# EasyEDA Pro project ProPrj_SRC_Robot2025_V1.0_2026-09-06.epro, board PCB-CTRL
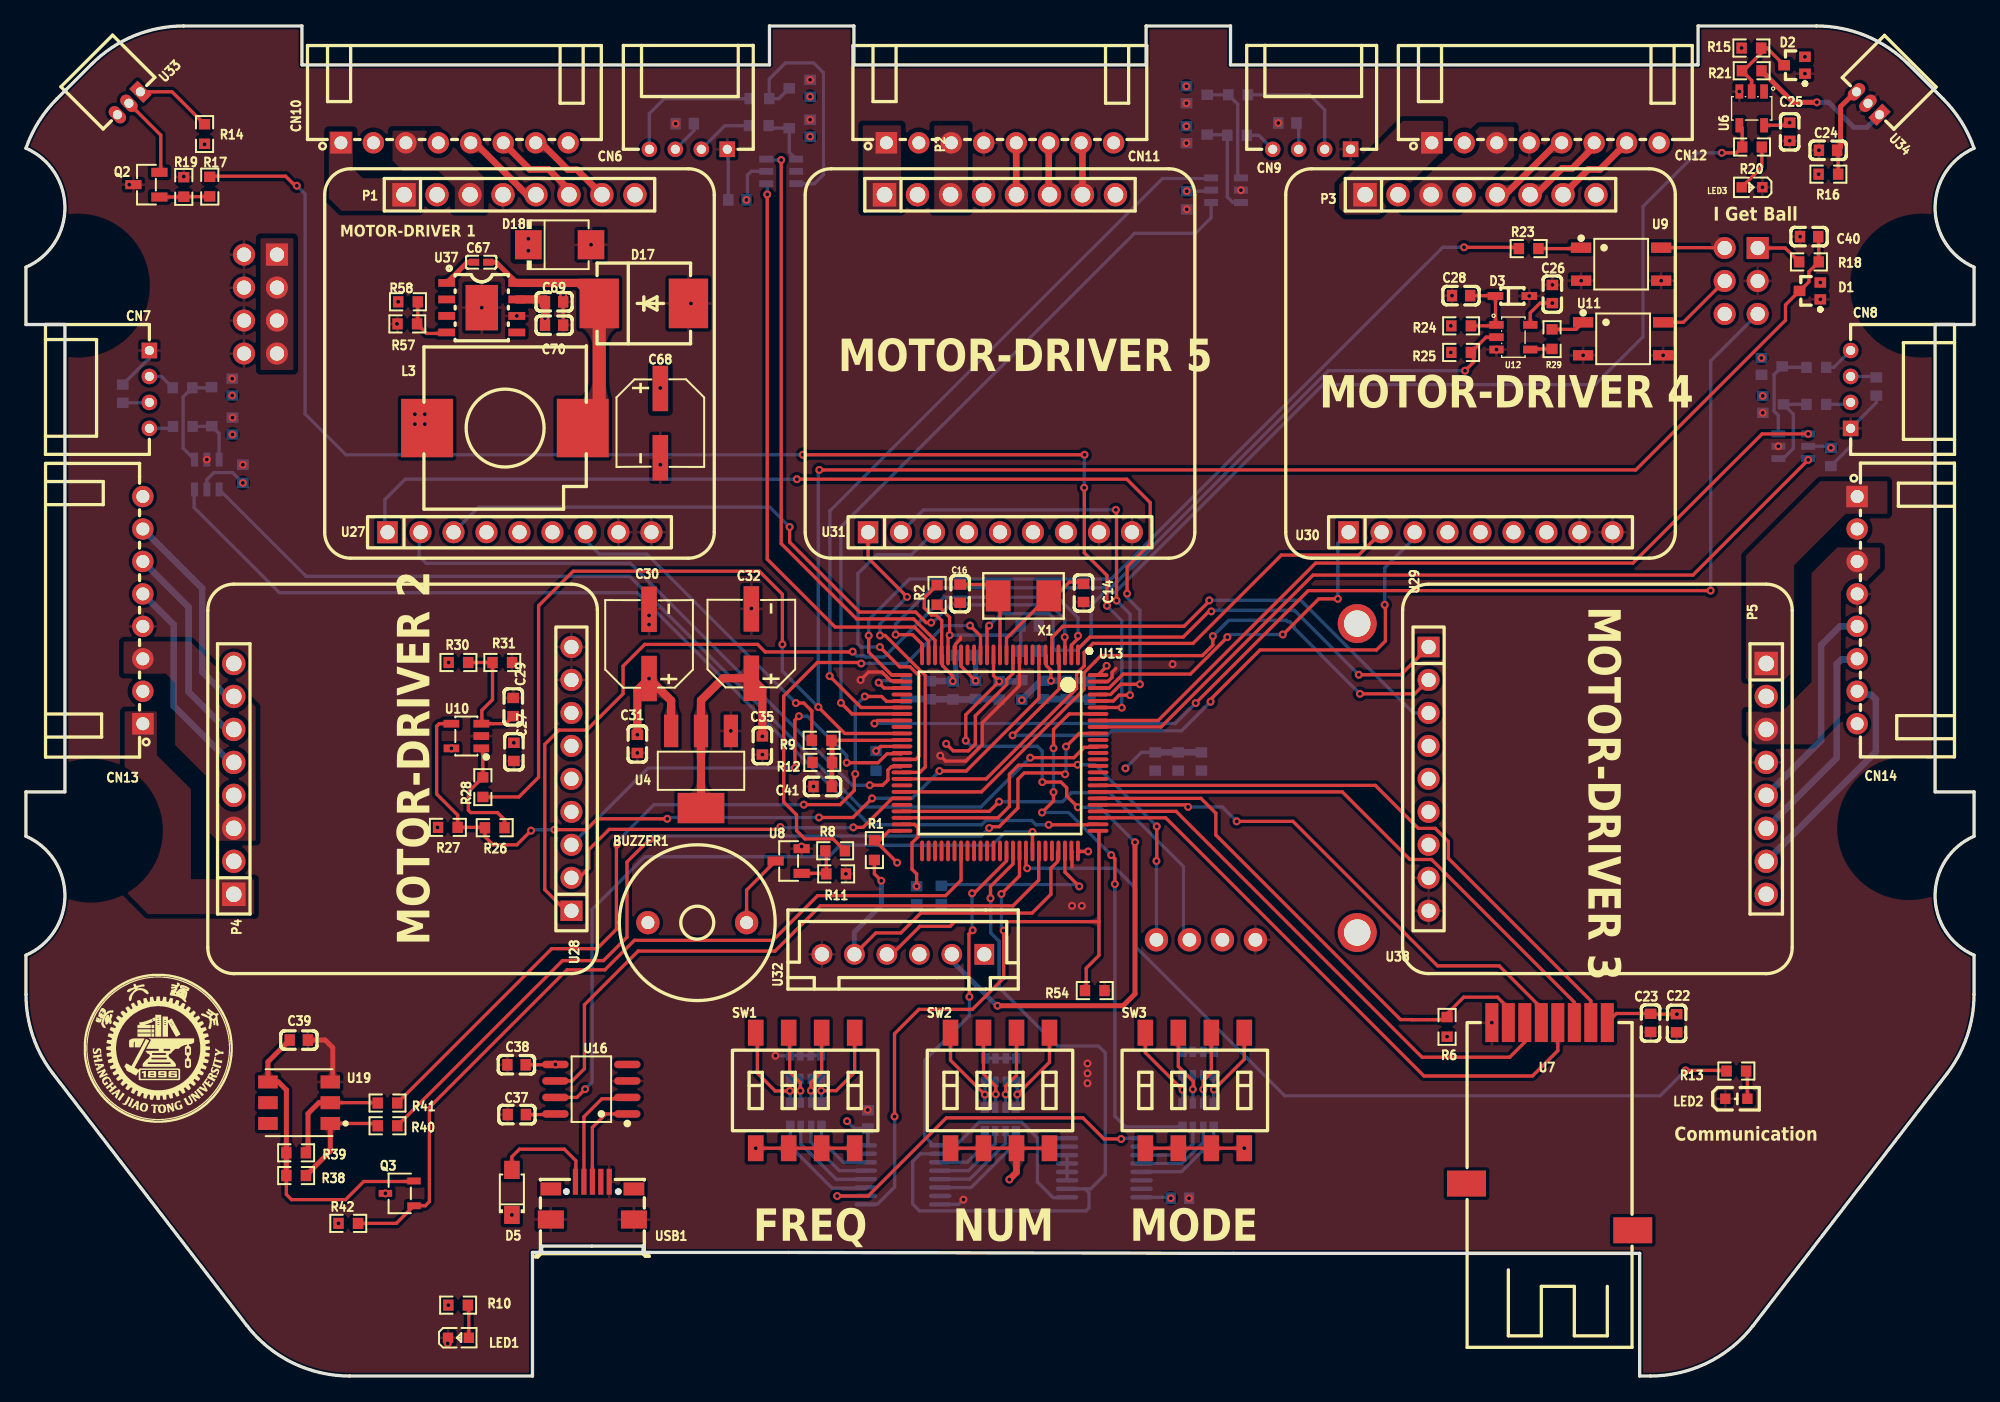
[diagram p15: board, top side]
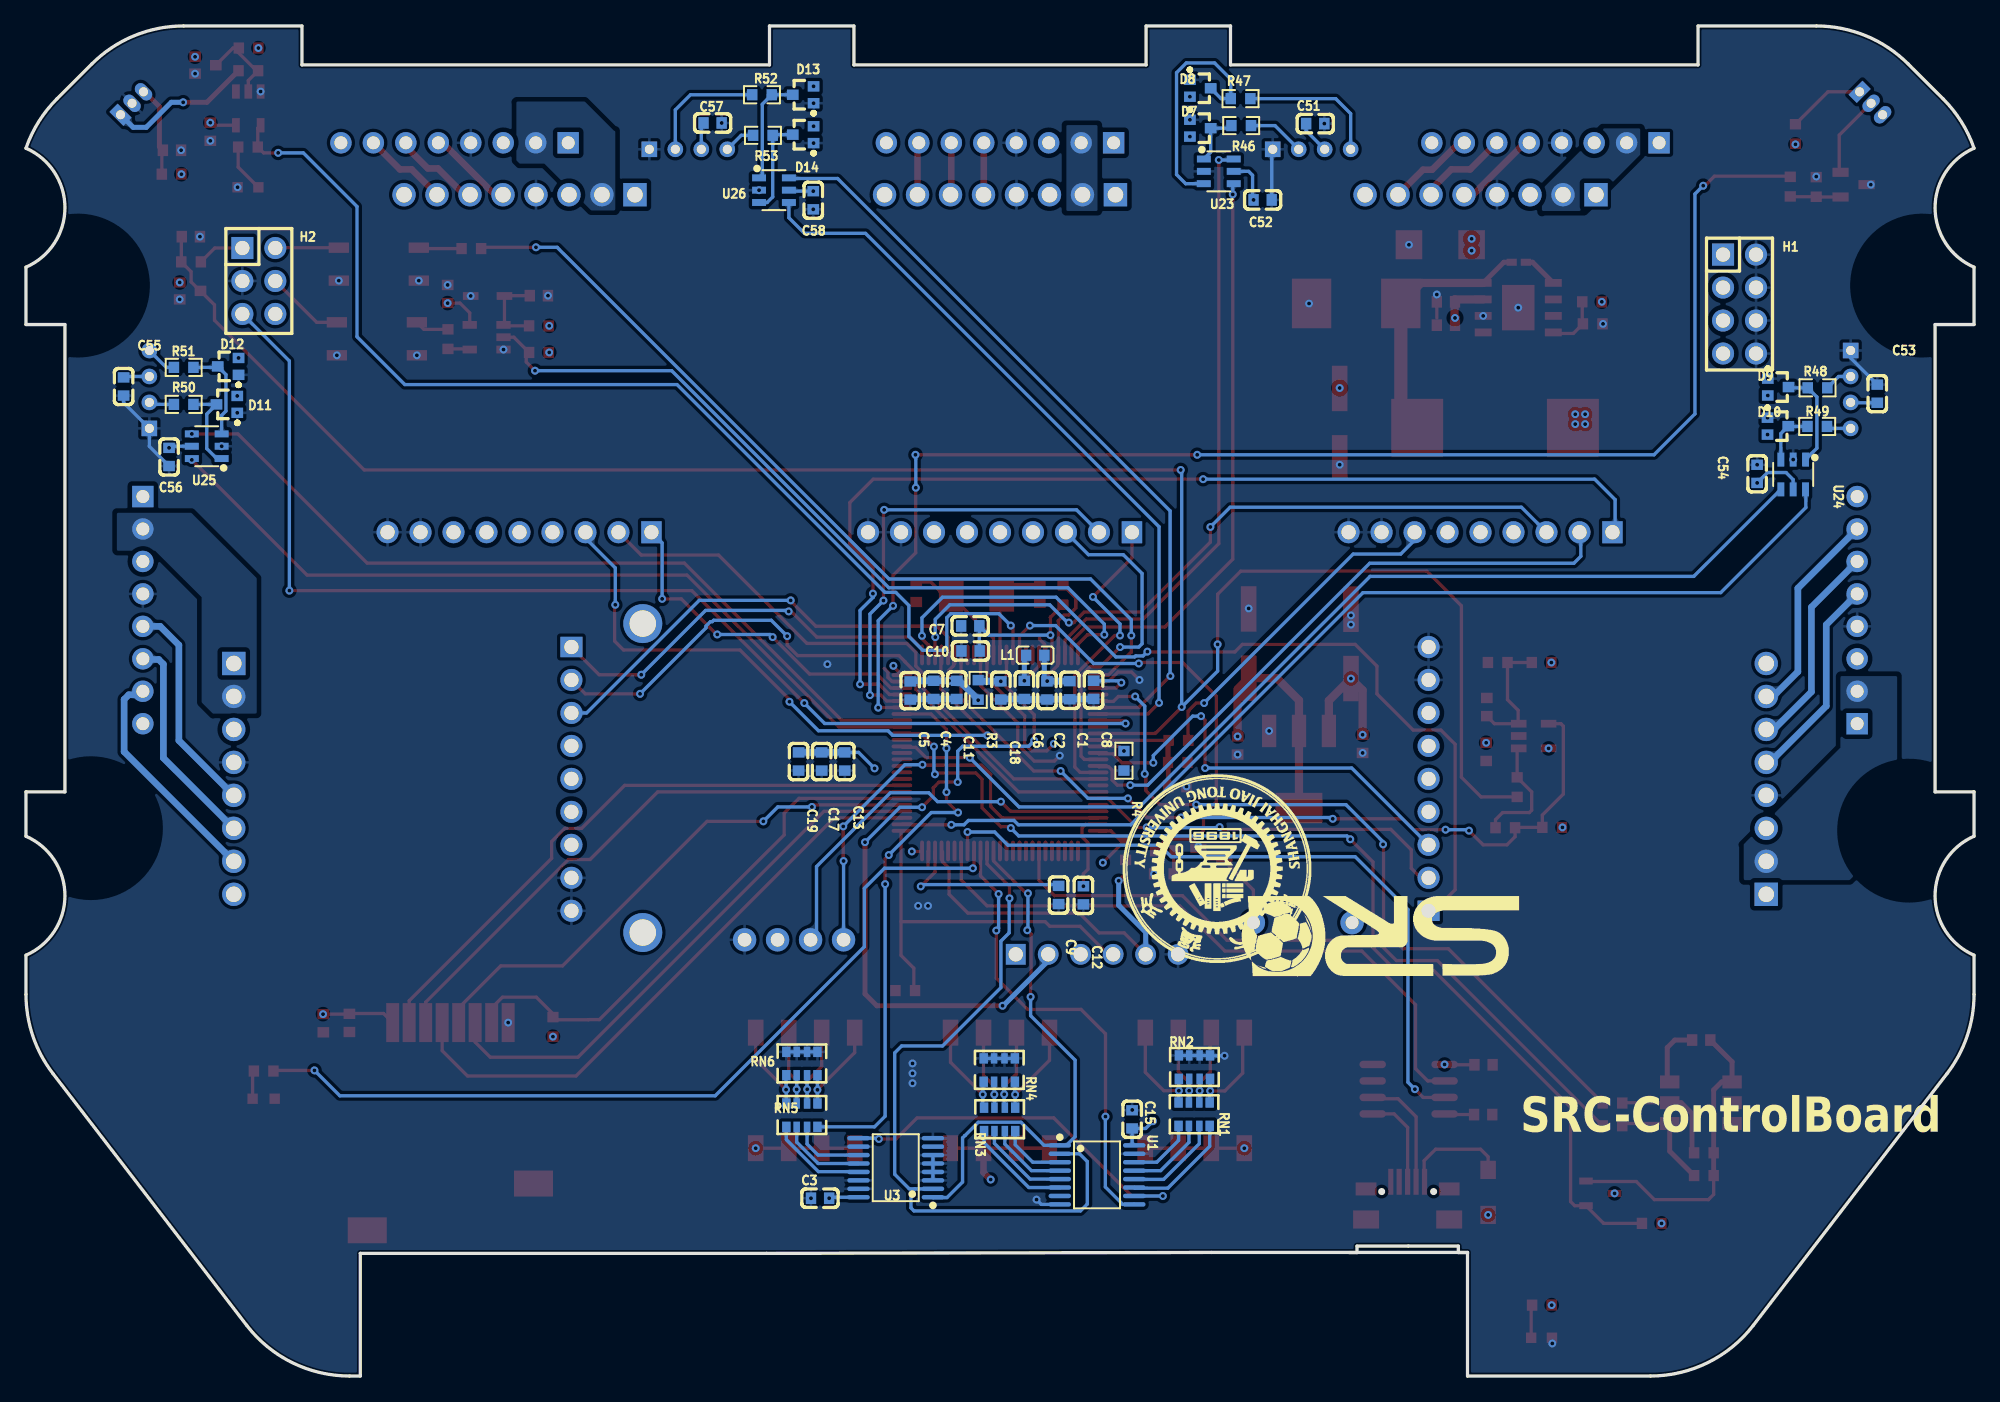
[diagram p16: board, bottom side, seen from below]

Outline 150 x 104 mm; copper layers: Top Layer, Inner1, Inner2, Bottom Layer. Coordinates in mm from the lower left corner of the outline.
Outline path: 0,94.58 arc(3,90) 0,85.42 0,81 3,81 3,45 0,45 0,41.58 arc(3,37) 0,32.42 0,29.4 arc(0.53,26.18) 2.07,23.3 17,3.9 arc(20.51,1.03) 24.92,0 39,0 39,9.52 58.71,9.52 92.97,9.45 124.26,9.45 124.26,0 125.08,0 arc(129.49,1.03) 133,3.9 147.93,23.3 arc(149.47,26.18) 150,29.4 150,32.42 arc(147,37) 150,41.58 150,45 147,45 147,81 150,81 150,85.42 arc(147,90) 150,94.58 arc(149.03,96.61) 147.62,98.38 144.93,101.07 arc(141.68,103.24) 137.86,104 128.75,104 128.75,101 92.75,101 92.75,104 86.25,104 86.25,101 63.75,101 63.75,104 57.25,104 57.25,101 21.25,101 21.25,104 12.14,104 arc(8.32,103.24) 5.07,101.07 2.38,98.38 arc(0.97,96.61) 0,94.58
Stack: Top Layer 0.035mm 外层铜厚1oz / Dielectric1 0.2104mm 7628 RC49% 8.6mil / Inner1 0.0152mm 内层铜厚 / Dielectric2 1.065mm 1.1mm H/HOZ Copper / Inner2 0.0152mm 内层铜厚 / Dielectric3 0.2104mm 7628 RC49% 8.6mil / Bottom Layer 0.035mm 外层铜厚1oz

## Design rules (mm)
template: 自定义配置
spacing copperThickness1oz (default): track to track 0.102, other pairs 0.122 to 0.3
spacing copperThickness2oz: track to track 0.203, other pairs 0.152 to 0.3
track width copperThickness1oz (default): min 0.127, default 0.254, max 2.54
track width copperThickness2oz: min 0.203, default 0.254, max 2.54
differential pair differentialPair (default): width min 0.127, default 0.254, max 2.54; gap min 0.152, default 0.152
via viaSize (default): diameter min 0.5, default 0.61, max 10; hole min 0.3, default 0.305, max 6.3
net +16V uses copperRegion1, innerPlane1
net $3N6153 uses copperRegion1
net $3N6155 uses copperRegion1
net $3N6149 uses copperRegion1
net $3N5988 uses copperRegion1
net $3N5983 uses copperRegion1
net $3N6290 uses copperRegion1
net $3N6296 uses copperRegion1
net $3N6294 uses copperRegion1
net $3N6431 uses copperRegion1
net $3N6437 uses copperRegion1
net $3N6435 uses copperRegion1
net $3N6572 uses copperRegion1
net $3N6578 uses copperRegion1
net $3N6576 uses copperRegion1
pour e215 uses copperRegion1

## Placement (name value [footprint] x y rotation side)
BUZZER1  2.4kHz  [BUZ-TH_BD12.0-P7.60-D0.6-FD]  51.69 34.92 0 top
C1  2.2uF  [C0603]  69.62 52.83 90 bottom
C2  0.1uF  [C0603]  71.38 52.81 90 bottom
C3  100nF  [C0603]  88.85 13.7 180 bottom
C4  10uF  [C0603]  80.11 52.86 90 bottom
C5  10uF  [C0603]  81.91 52.81 90 bottom
C6  100nF  [C0603]  73.13 52.86 90 bottom
C7  2.2uF  [C0603]  77.29 57.78 180 bottom
C8  100nF  [C0603]  67.79 52.86 90 bottom
C9  2.2uF  [C0603]  70.49 37.06 90 bottom
C10  0.1uF  [C0603]  77.27 55.85 180 bottom
C11  100nF  [C0603]  78.33 52.86 90 bottom
C12  2.2uF  [C0603]  68.58 37.03 90 bottom
C13  100nF  [C0603]  86.95 47.34 90 bottom
C14  18pF  [C0603]  81.43 60.32 90 top
C15  100nF  [C0603]  64.83 19.77 270 bottom
C16  18pF  [C0603]  71.93 60.27 90 top
C17  100nF  [C0603]  88.73 47.34 90 bottom
C18  100nF  [C0603]  74.94 52.81 270 bottom
C19  100nF  [C0603]  90.51 47.34 90 bottom
C22  10uF  [C0603]  127.1 27.18 90 top
C23  100nF  [C0603]  125.09 27.2 90 top
C24  4.7uF  [C0603]  138.76 94.43 180 top
C25  100nF  [C0603]  135.81 95.85 90 top
C26  100nF  [C0603]  117.53 83.35 90 top
C27  100nF  [C0603]  37.57 48.08 270 top
C28  100nF  [C0603]  110.51 83.22 0 top
C29  100nF  [C0603]  37.52 51.54 270 top
C30  220uF  [CAP-SMD_BD6.3-L6.6-W6.6-FD]  47.98 56.4 90 top
C31  22uF  [C0603]  47.08 48.7 90 top
C32  220uF  [CAP-SMD_BD6.3-L6.6-W6.6-FD]  55.85 56.42 90 top
C35  10uF  [C0603]  56.7 48.57 90 top
C37  10nF  [C0603]  37.8 20.14 180 top
C38  10nF  [C0603]  37.77 23.98 0 top
C39  22uF  [C0603]  21.01 25.88 180 top
C40  100nF  [C0603]  137.3 87.77 0 top
C41  100nF  [C0603]  61.34 45.41 0 top
C51  4.7uF  [C0603]  50.73 96.48 180 bottom
C52  100nF  [C0603]  54.78 90.6 0 bottom
C53  4.7uF  [C0603]  7.45 75.67 90 bottom
C54  100nF  [C0603]  16.7 69.5 270 bottom
C55  4.7uF  [C0603]  142.48 76.22 270 bottom
C56  100nF  [C0603]  138.98 70.8 90 bottom
C57  4.7uF  [C0603]  97.13 96.53 180 bottom
C58  100nF  [C0603]  89.38 90.58 90 bottom
C67  100nF  [C0402]  35.05 85.8 0 top
C68  100uF  [CAP-SMD_BD6.3-L6.6-W6.6-LS7.2-FD]  48.84 73.41 270 top
C69  10uF  [C0603]  40.67 82.75 180 top
C70  10uF  [C0603]  40.67 80.95 180 top
CN6  L200HY-W-4A  [CONN-TH_L200HY-W-4A]  51 94.5 180 top
CN7  L200HY-W-4A  [CONN-TH_L200HY-W-4A]  9.5 76 270 top
CN8  L200HY-W-4A  [CONN-TH_L200HY-W-4A]  140.5 76 90 top
CN9  L200HY-W-4A  [CONN-TH_L200HY-W-4A]  99 94.5 180 top
CN10  HC-XHB-8AW  [CONN-TH_HC-XHB-8AW]  33 95 0 top
CN11  HC-XHB-8AW  [CONN-TH_HC-XHB-8AW]  75 95 0 top
CN12  HC-XHB-8AW  [CONN-TH_HC-XHB-8AW]  117 95 0 top
CN13  HC-XHB-8AW  [CONN-TH_HC-XHB-8AW]  9 59 90 top
CN14  HC-XHB-8AW  [CONN-TH_HC-XHB-8AW]  141 59 270 top
D1  BAV99W,115  [SOT-323_L2.0-W1.3-P1.30-LS2.1-BR]  137.36 83.59 0 top
D2  BAV99W,115  [SOT-323_L2.0-W1.3-P1.30-LS2.1-BR]  136.18 100.98 0 top
D3  PESD3V3L1UA  [SOD-323_L1.6-W1.3-LS2.6-RD]  114.46 83.2 0 top
D5  DSS34_C511866  [SOD-123FL_L2.7-W1.8-LS3.8-RD]  37.41 14.15 90 top
D7  BAV99W,115  [SOT-323_L2.0-W1.3-P1.30-LS2.1-BR]  59.58 96.13 0 bottom
D8  BAV99W,115  [SOT-323_L2.0-W1.3-P1.30-LS2.1-BR]  59.58 99.2 0 bottom
D9  BAV99W,115  [SOT-323_L2.0-W1.3-P1.30-LS2.1-BR]  15.08 76.18 0 bottom
D10  BAV99W,115  [SOT-323_L2.0-W1.3-P1.30-LS2.1-BR]  15.1 73.17 0 bottom
D11  BAV99W,115  [SOT-323_L2.0-W1.3-P1.30-LS2.1-BR]  134.53 74.85 180 bottom
D12  BAV99W,115  [SOT-323_L2.0-W1.3-P1.30-LS2.1-BR]  134.43 77.78 180 bottom
D13  BAV99W,115  [SOT-323_L2.0-W1.3-P1.30-LS2.1-BR]  90.15 98.7 180 bottom
D14  BAV99W,115  [SOT-323_L2.0-W1.3-P1.30-LS2.1-BR]  90.15 95.63 180 bottom
D17  B540C-13-F  [SMC_L7.1-W6.2-LS8.1-RD]  47.57 82.63 0 top
D18  SMBJ18A-E3/52  [SMB_L4.6-W3.6-LS5.4-RD]  41.1 87.15 0 top
H1  PZ254V-12-8P  [HDR-TH_8P-P2.54-V-M-R2-C4-S2.54]  18.06 82.58 270 bottom
H2  PZ254V-12-6P  [HDR-TH_6P-P2.54-V-M-R2-C3-S2.54]  132.07 84.36 270 bottom
L1  MPZ1608S101ATDH5  [L0603]  72.29 55.52 180 bottom
L3  22uH  [IND-SMD_L12.5-W12.5_SLF12555T]  36.88 73.02 180 top
LED1  NCD0603B1  [LED0603-RD]  33.3 2.95 0 top
LED2  XL-1608UOC-06  [LED0603-R-RD_ORANGE]  131.7 21.36 0 top
LED3  LTST-C191KSKT  [LED0603-RD-YELLOW]  132.91 91.58 180 top
P1  2.54-1*8P  [HDR-TH_8P-P2.54-V-F-1]  38 91 0 top
P2  2.54-1*8P  [HDR-TH_8P-P2.54-V-F-1]  75 91 0 top
P3  2.54-1*8P  [HDR-TH_8P-P2.54-V-F-1]  112 91 0 top
P4  2.54-1*8P  [HDR-TH_8P-P2.54-V-F-1]  16 46 90 top
P5  2.54-1*8P  [HDR-TH_8P-P2.54-V-F-1]  134 46 270 top
Q2  CJ2302  [SOT-23-3_L2.9-W1.3-P1.90-LS2.4-BR]  9.28 91.78 0 top
Q3  CJ2301 S1  [SOT-23-3_L3.0-W1.7-P0.95-LS2.9-BR]  28.78 14.07 0 top
R1  10K  [R0603]  65.33 40.51 270 top
R2  22R  [R0603]  70.16 60.17 90 top
R3  10K  [R0603]  76.68 52.86 270 bottom
R4  5.1K  [R0603]  65.46 47.4 270 bottom
R6  10K  [R0603]  109.42 26.9 90 top
R8  2.2K  [R0603]  62.31 40.46 180 top
R9  22K  [R0603]  61.26 48.97 180 top
R10  1K  [R0603]  33.27 5.46 0 top
R11  1K  [R0603]  62.38 38.68 180 top
R12  3.3K  [R0603]  61.32 47.27 0 top
R13  680R  [R0603]  131.7 23.49 0 top
R14  10Ω  [R0603]  13.75 95.68 90 top
R15  10K  [R0603]  132.86 102.3 180 top
R16  100R  [R0603]  138.79 92.58 180 top
R17  100R  [R0603]  14.15 91.63 270 top
R18  1K  [R0603]  137.29 85.83 180 top
R19  3.3K  [R0603]  12.15 91.6 270 top
R20  680R  [R0603]  132.91 94.68 180 top
R21  1K  [R0603]  132.88 100.55 0 top
R23  1K  [R0603]  115.71 86.85 0 top
R24  10K  [R0603]  110.51 80.9 180 top
R25  10K  [R0603]  110.51 78.85 180 top
R26  100K  [R0603]  36.09 42.24 180 top
R27  5.1K  [R0603]  32.49 42.27 180 top
R28  1K  [R0603]  35.18 45.36 90 top
R29  1K  [R0603]  117.51 79.88 90 top
R30  10K  [R0603]  33.3 54.97 180 top
R31  1.5K  [R0603]  36.68 54.97 180 top
R38  4.99K  [R0603]  20.8 15.44 180 top
R39  4.99K  [R0603]  20.8 17.19 180 top
R40  1K  [R0603]  27.84 19.28 180 top
R41  1K  [R0603]  27.84 21.03 180 top
R42  10K  [R0603]  24.82 11.76 0 top
R46  330Ω  [R0603]  56.43 96.33 180 bottom
R47  330Ω  [R0603]  56.48 98.4 180 bottom
R48  330Ω  [R0603]  12.05 76.12 180 bottom
R49  330Ω  [R0603]  12.08 73.15 180 bottom
R50  330Ω  [R0603]  137.86 74.85 0 bottom
R51  330Ω  [R0603]  137.86 77.7 0 bottom
R52  330Ω  [R0603]  93.33 98.7 0 bottom
R53  330Ω  [R0603]  93.25 95.58 0 bottom
R54  10KR  [R0603]  82.3 29.69 180 top
R57  3.24K  [R0603]  29.36 81.05 180 top
R58  10K  [R0603]  29.41 82.75 180 top
RN1  1kΩ  [RES-ARRAY-SMD_0603-8P-L3.2-W1.6-BL]  60.05 20.17 0 bottom
RN2  5.1kΩ  [RES-ARRAY-SMD_0603-8P-L3.2-W1.6-BL]  60.03 23.8 180 bottom
RN3  1kΩ  [RES-ARRAY-SMD_0603-8P-L3.2-W1.6-BL]  75.03 19.77 180 bottom
RN4  5.1kΩ  [RES-ARRAY-SMD_0603-8P-L3.2-W1.6-BL]  75.05 23.57 180 bottom
RN5  1kΩ  [RES-ARRAY-SMD_0603-8P-L3.2-W1.6-BL]  90.25 20.1 180 bottom
RN6  5.1kΩ  [RES-ARRAY-SMD_0603-8P-L3.2-W1.6-BL]  90.25 24.07 180 bottom
SW1  DM-04-V  [SW-SMD_8P-L11.1-W6.2-P2.54-LS9.8]  60 22 0 top
SW2  DM-04-V  [SW-SMD_8P-L11.1-W6.2-P2.54-LS9.8]  75 22 0 top
SW3  DM-04-V  [SW-SMD_8P-L11.1-W6.2-P2.54-LS9.8]  90 22 0 top
U1  SN74HC165PW  [TSSOP-16_L5.0-W4.4-P0.65-LS6.4-BL]  67.53 15.5 270 bottom
U3  SN74HC165PW  [TSSOP-16_L5.0-W4.4-P0.65-LS6.4-BL]  83.03 16.05 90 bottom
U4  AMS1117-3.3  [SOT-223-3_L6.5-W3.4-P2.30-LS7.0-BR]  51.98 46.72 90 top
U6  SN74LVC1G17DBVR  [SOT-23-5_L3.0-W1.7-P0.95-LS2.8-BR]  132.88 97.65 90 top
U7  E01-ML01SP2  [WIRELM-SMD_E01-ML01SP2]  117.32 19.23 180 top
U8  MMBT3904  [SOT-23-3_L2.9-W1.3-P1.90-LS2.4-BR]  58.72 39.67 0 top
U9  EL357N(D)(TA)-G  [SOP-4_L3.9-W4.4-P2.54-LS7.0-TL]  122.83 85.65 0 top
U10  LMV331ILT  [SOT-23-5_L3.0-W1.6-P0.95-LS2.8-BR]  33.91 49.3 0 top
U11  EL357N(D)(TA)-G  [SOP-4_L3.9-W4.4-P2.54-LS7.0-TL]  122.98 79.9 0 top
U12  SN74LVC1G00DBVR  [SOT-23-5_L3.0-W1.7-P0.95-LS2.8-BR]  114.53 80.03 180 top
U13  STM32F407VET6  [LQFP-100_L14.0-W14.0-P0.50-LS16.0-BL]  75 48 180 top
U16  CH340N  [SOP-8_L5.0-W4.0-P1.27-LS6.0-BL]  43.54 22.1 90 top
U19  SK9822  [SMD_6P-L5.0-W5.0-TL]  21.03 21.06 180 top
U23  SN74LVC2G17DBVR  [SOT-23-6_L2.9-W1.6-P0.95-LS2.8-BL]  58.15 92.8 270 bottom
U24  SN74LVC2G17DBVR  [SOT-23-6_L2.9-W1.6-P0.95-LS2.8-BL]  13.93 69.45 0 bottom
U25  SN74LVC2G17DBVR  [SOT-23-6_L2.9-W1.6-P0.95-LS2.8-BL]  136.08 71.62 90 bottom
U26  SN74LVC2G17DBVR  [SOT-23-6_L2.9-W1.6-P0.95-LS2.8-BL]  92.4 91.35 270 bottom
U27  PM254-1-09-Z-8.5  [HDR-TH_9P-P2.54-V-F]  38 65 0 top
U28  PM254-1-09-Z-8.5  [HDR-TH_9P-P2.54-V-F]  42 46 90 top
U29  PM254-1-09-Z-8.5  [HDR-TH_9P-P2.54-V-F]  108 46 270 top
U30  PM254-1-09-Z-8.5  [HDR-TH_9P-P2.54-V-F]  112 65 0 top
U31  PM254-1-09-Z-8.5  [HDR-TH_9P-P2.54-V-F]  75 65 0 top
U32  ZX-XH2.54-6PZZ  [CONN-TH_6P-P2.50_ZX-XH2.54-6PZZ]  67.54 32.49 0 top
U33  BX-MX1.25-3PWZ  [CONN-TH_3P-P1.25_BX-MX1.25-3PWZ]  7.92 98.04 225 top
U34  BX-MX1.25-3PWZ  [CONN-TH_3P-P1.25_BX-MX1.25-3PWZ]  141.83 98.04 135 top
U37  TPS5430DDAR  [ESOP-8_L4.9-W3.9-P1.27-LS6.0-TL-EP]  35.09 82.3 0 top
U38  HS96L03W2C03  [OLED-TH_L27.8-W27.2-P2.54_C9900033791]  90.86 33.6 180 top
USB1  MicroQTJ  [MICRO-USB-SMD_MICROQTJ]  43.61 13.51 0 top
X1  25MHz  [OSC-SMD_2P-L5.0-W3.2]  76.81 60.1 0 top

## Footprints (pads in the part's own frame, mm; a bottom-side part is the same pattern mirrored in y, then rotated)
BUZ-TH_BD12.0-P7.60-D0.6-FD
  round 1.8 hole 1: 1(-3.8,0) 2(3.8,0)
C0402
  rect 0.79x0.54 smd: 1(-0.545,0) 2(0.545,0)
C0603
  rect 0.8x0.9 smd: 1(-0.7,0) 2(0.7,0)
CAP-SMD_BD6.3-L6.6-W6.6-FD
  rect 3.5x1.2 smd: 1(-2.67,0) 2(2.67,0)
CAP-SMD_BD6.3-L6.6-W6.6-LS7.2-FD
  rect 3.5x1.2 smd: 1(-2.67,0) 2(2.67,0)
CONN-TH_3P-P1.25_BX-MX1.25-3PWZ
  rect 0.9x1.524 hole 0.7: 1(-1.25,0)
  oval 0.9x1.524 hole 0.7: 2(0,0) 3(1.25,0)
CONN-TH_6P-P2.50_ZX-XH2.54-6PZZ
  rect 1.524x1.6 hole 1.1: 1(6.25,0)
  round 1.6 hole 1.1: 2(3.75,0) 3(1.25,0) 4(-1.25,0) 5(-3.75,0) 6(-6.25,0)
CONN-TH_HC-XHB-8AW
  rect 1.65x1.65 hole 1: 1(-8.75,0)
  round 1.65 hole 1: 2(-6.25,0) 3(-3.75,0) 4(-1.25,0) 5(1.25,0) 6(3.75,0) 7(6.25,0) 8(8.75,0)
CONN-TH_L200HY-W-4A
  rect 1.2x1.2 hole 0.7: 1(-3,0)
  round 1.2 hole 0.7: 2(-1,0) 3(1,0) 4(3,0)
ESOP-8_L4.9-W3.9-P1.27-LS6.0-TL-EP
  rect 1.3x0.6 smd: 1(-2.7,1.905) 2(-2.7,0.635) 3(-2.7,-0.635) 4(-2.7,-1.905) 5(2.7,-1.905) 6(2.7,-0.635) 7(2.7,0.635) 8(2.7,1.905)
  rect 2.5x3.5 smd: 9(0,0)
HDR-TH_6P-P2.54-V-M-R2-C3-S2.54
  rect 1.7x1.7 hole 1.1: 1(-2.54,-1.27)
  round 1.7 hole 1.1: 2(-2.54,1.27) 3(0,-1.27) 4(0,1.27) 5(2.54,-1.27) 6(2.54,1.27)
HDR-TH_8P-P2.54-V-F-1
  rect 1.8x1.8 hole 1.2: 1(-8.89,0)
  round 1.8 hole 1.2: 2(-6.35,0) 3(-3.81,0) 4(-1.27,0) 5(1.27,0) 6(3.81,0) 7(6.35,0) 8(8.89,0)
HDR-TH_8P-P2.54-V-M-R2-C4-S2.54
  rect 1.7x1.7 hole 1.1: 1(-3.81,-1.27)
  round 1.7 hole 1.1: 2(-3.81,1.27) 3(-1.27,-1.27) 4(-1.27,1.27) 5(1.27,-1.27) 6(1.27,1.27) 7(3.81,-1.27) 8(3.81,1.27)
HDR-TH_9P-P2.54-V-F
  rect 1.575x1.7 hole 1.1: 1(-10.16,0)
  round 1.7 hole 1.1: 2(-7.62,0) 3(-5.08,0) 4(-2.54,0) 5(0,0) 6(2.54,0) 7(5.08,0) 8(7.62,0) 9(10.16,0)
IND-SMD_L12.5-W12.5_SLF12555T
  rect 4x4.5 smd: 1(-5.995,0) 2(5.995,0)
L0603
  rect 0.8x0.864 smd: 1(-0.7,0) 2(0.7,0)
LED0603-R-RD_ORANGE
  rect 0.8x0.8 smd: 1(0.851,0) 2(-0.851,0)
LED0603-RD
  rect 0.8x0.8 smd: 1(-0.799,0) 2(0.799,0)
LED0603-RD-YELLOW
  rect 0.8x0.8 smd: 1(-0.799,-0.004) 2(0.799,0.004)
LQFP-100_L14.0-W14.0-P0.50-LS16.0-BL
  oval 0.3x1.6 smd: 1(-6,-7.55) 2(-5.5,-7.55) 3(-5,-7.55) 4(-4.5,-7.55) 5(-4,-7.55) 6(-3.5,-7.55) 7(-3,-7.55) 8(-2.5,-7.55) 9(-2,-7.55) 10(-1.5,-7.55) 11(-1,-7.55) 12(-0.5,-7.55) 13(0,-7.55) 14(0.5,-7.55) 15(1,-7.55) 16(1.5,-7.55) 17(2,-7.55) 18(2.5,-7.55) 19(3,-7.55) 20(3.5,-7.55) 21(4,-7.55) 22(4.5,-7.55) 23(5,-7.55) 24(5.5,-7.55) 25(6,-7.55) 51(6,7.55) 52(5.5,7.55) 53(5,7.55) 54(4.5,7.55) 55(4,7.55) 56(3.5,7.55) 57(3,7.55) 58(2.5,7.55) 59(2,7.55) 60(1.5,7.55) 61(1,7.55) 62(0.5,7.55) 63(0,7.55) 64(-0.5,7.55) 65(-1,7.55) 66(-1.5,7.55) 67(-2,7.55) 68(-2.5,7.55) 69(-3,7.55) 70(-3.5,7.55) 71(-4,7.55) 72(-4.5,7.55) 73(-5,7.55) 74(-5.5,7.55) 75(-6,7.55)
  oval 1.6x0.3 smd: 26(7.55,-6) 27(7.55,-5.5) 28(7.55,-5) 29(7.55,-4.5) 30(7.55,-4) 31(7.55,-3.5) 32(7.55,-3) 33(7.55,-2.5) 34(7.55,-2) 35(7.55,-1.5) 36(7.55,-1) 37(7.55,-0.5) 38(7.55,0) 39(7.55,0.5) 40(7.55,1) 41(7.55,1.5) 42(7.55,2) 43(7.55,2.5) 44(7.55,3) 45(7.55,3.5) 46(7.55,4) 47(7.55,4.5) 48(7.55,5) 49(7.55,5.5) 50(7.55,6) 76(-7.55,6) 77(-7.55,5.5) 78(-7.55,5) 79(-7.55,4.5) 80(-7.55,4) 81(-7.55,3.5) 82(-7.55,3) 83(-7.55,2.5) 84(-7.55,2) 85(-7.55,1.5) 86(-7.55,1) 87(-7.55,0.5) 88(-7.55,0) 89(-7.55,-0.5) 90(-7.55,-1) 91(-7.55,-1.5) 92(-7.55,-2) 93(-7.55,-2.5) 94(-7.55,-3) 95(-7.55,-3.5) 96(-7.55,-4) 97(-7.55,-4.5) 98(-7.55,-5) 99(-7.55,-5.5) 100(-7.55,-6)
MICRO-USB-SMD_MICROQTJ
  rect 0.4x2 smd: 1(-1.3,1.452) 2(-0.65,1.452) 3(0,1.452) 4(0.65,1.452) 5(1.3,1.452)
  rect 1.6x1 smd: 6(-3.2,0.901) 9(3.2,0.901)
  rect 2x1.4 smd: 7(-3.2,-1.452) 8(3.2,-1.452)
OLED-TH_L27.8-W27.2-P2.54_C9900033791
  round 1.8 hole 1.05: 1(-3.81,0) 2(-1.27,0) 3(1.27,0) 4(3.81,0)
  round 3 hole 2.04: 5(-11.65,-0.56) 5(-11.65,-24.36)
OSC-SMD_2P-L5.0-W3.2
  rect 1.9x2.4 smd: 1(-1.95,0) 2(1.95,0)
R0603
  rect 0.806x0.864 smd: 1(-0.753,0) 2(0.753,0)
RES-ARRAY-SMD_0603-8P-L3.2-W1.6-BL
  rect 0.65x0.8 smd: 1(-1.2,-0.9) 4(1.2,-0.9) 5(1.2,0.9) 8(-1.2,0.9)
  rect 0.5x0.8 smd: 2(-0.4,-0.9) 3(0.4,-0.9) 6(0.4,0.9) 7(-0.4,0.9)
SMB_L4.6-W3.6-LS5.4-RD
  rect 2.047x2.241 smd: 1(-2.413,0) 2(2.413,0)
SMC_L7.1-W6.2-LS8.1-RD
  rect 3.03x3.82 smd: 1(-3.435,0) 2(3.435,0)
SMD_6P-L5.0-W5.0-TL
  rect 1.5x1 smd: 1(-2.4,1.6) 2(-2.4,0) 3(-2.4,-1.6) 4(2.4,-1.6) 5(2.4,0) 6(2.4,1.6)
SOD-123FL_L2.7-W1.8-LS3.8-RD
  rect 1.4x1.2 smd: 1(-1.735,0) 2(1.735,0)
SOD-323_L1.6-W1.3-LS2.6-RD
  rect 1.2x0.6 smd: 1(-1.3,0) 2(1.3,0)
SOP-4_L3.9-W4.4-P2.54-LS7.0-TL
  rect 1.56x0.8 smd: 1(-3.08,1.27) 2(-3.08,-1.27) 3(3.08,-1.27) 4(3.08,1.27)
SOP-8_L5.0-W4.0-P1.27-LS6.0-BL
  oval 0.574x2.035 smd: 1(-1.905,-2.768) 2(-0.635,-2.768) 3(0.635,-2.768) 4(1.905,-2.768) 5(1.905,2.768) 6(0.635,2.768) 7(-0.635,2.768) 8(-1.905,2.768)
SOT-23-3_L2.9-W1.3-P1.90-LS2.4-BR
  rect 1.25x0.7 smd: 1(1,-0.95) 2(1,0.95) 3(-1,0)
SOT-23-3_L3.0-W1.7-P0.95-LS2.9-BR
  rect 1.038x0.532 smd: 1(1.101,-0.95) 2(1.101,0.95) 3(-1.101,0)
SOT-23-5_L3.0-W1.6-P0.95-LS2.8-BR
  rect 1.2x0.6 smd: 1(1.15,-0.95) 2(1.15,0) 3(1.15,0.95) 4(-1.15,0.95) 5(-1.15,-0.95)
SOT-23-5_L3.0-W1.7-P0.95-LS2.8-BR
  rect 1.1x0.6 smd: 1(1.3,-0.95) 2(1.3,0) 3(1.3,0.95) 4(-1.3,0.95) 5(-1.3,-0.95)
SOT-23-6_L2.9-W1.6-P0.95-LS2.8-BL
  rect 0.532x1.072 smd: 1(-0.95,-1.149) 2(0,-1.149) 3(0.95,-1.149) 4(0.95,1.149) 5(0,1.149) 6(-0.95,1.149)
SOT-223-3_L6.5-W3.4-P2.30-LS7.0-BR
  rect 2.5x1.1 smd: 1(2.97,-2.3) 2(2.97,0) 3(2.97,2.3)
  rect 2.34x3.6 smd: 4(-2.97,0)
SOT-323_L2.0-W1.3-P1.30-LS2.1-BR
  rect 0.9x0.8 smd: 1(0.8,-0.65) 2(0.8,0.65) 3(-0.8,0)
SW-SMD_8P-L11.1-W6.2-P2.54-LS9.8
  rect 1.2x2 smd: 1(-3.81,-4.45) 2(-1.27,-4.45) 3(1.27,-4.45) 4(3.81,-4.45) 5(3.81,4.45) 6(1.27,4.45) 7(-1.27,4.45) 8(-3.81,4.45)
TSSOP-16_L5.0-W4.4-P0.65-LS6.4-BL
  oval 0.343x1.732 smd: 1(-2.275,-2.866) 2(-1.625,-2.866) 3(-0.975,-2.866) 4(-0.325,-2.866) 5(0.325,-2.866) 6(0.975,-2.866) 7(1.625,-2.866) 8(2.275,-2.866) 9(2.275,2.866) 10(1.625,2.866) 11(0.975,2.866) 12(0.325,2.866) 13(-0.325,2.866) 14(-0.975,2.866) 15(-1.625,2.866) 16(-2.275,2.866)
WIRELM-SMD_E01-ML01SP2
  rect 1x3 smd: 1(-4.44,-8) 2(-3.17,-8) 3(-1.9,-8) 4(-0.63,-8) 5(0.64,-8) 6(1.91,-8) 7(3.18,-8) 8(4.45,-8)
  rect 3x2 smd: 9(-6.4,8) 10(6.4,4.4)

## Nets
As in the schematic.

Pads without a net: H2 6; U1 7; U3 7; U6 1; U7 9 10; U13 17 18 29 34 43 46 51 52 53 54 55 56 58 59 60 61 62 63 70 71 84 85 86 87 88 90; U16 4; U19 5 6; U32 3; U33 3; U37 2 3 5; U38 5; USB1 4 6 9

## Via types
v1: diameter 0.61, hole 0.305, Top Layer to Bottom Layer, 242 vias

## Routing (per net, layer and track width the routed paths; a pad name or vN(x,y) marks a point on that pad's centre or on a via; arc(x,y) is an arc through that point)
3V3: length 113.4
  Top Layer w0.254: v1(81.79,40.41) 81.04,40.41 U13.75 ; v1(70.85,48.7) 71.4,48.16 72.57,48.16 73.1,48.69 73.1,50.85 75.52,53.27 75.52,53.65 76,54.13 U13.11 ; v1(135.81,96.55) 135.61,96.35 133.83,96.35 ; v1(127.13,27.88) 125.04,27.88 124.99,27.93 122.46,27.93 U7.1 ; v1(93.81,17.55) SW3.3 SW3.2 SW3.1 ; C38.2 40.74,23.98 v1(40.77,24) ; v1(78.92,53.56) 78.92,54.37 78.57,54.72 78.57,55.48 U13.6 ; SW2.1 SW2.2 SW2.3 SW2.4 ; U13.19 72,54.68 v1(73.13,53.56) ; U13.100 83.21,54.66 v1(83.21,54.71) ; v1(56.19,17.55) SW1.2 SW1.3 SW1.4 ; R1.1 65.36,41.27 ; 65.36,41.27 65.73,41.27 66.46,42 U13.50 ; 65.36,41.27 v1(67.08,39.55) ; U13.28 66.07,53 v1(65.66,53.42) ; v1(117.53,82.65) 116.58,82.65 115.83,81.9 U12.5
  Top Layer w0.508: SW2.3 76.27,15.69 v1(75.72,15.14)
  Top Layer w0.635: v1(56.7,49.27) 56.7,52.9 C32.1 53.68,53.75 51.98,52.05 U4.2 U4.4
  Bottom Layer w0.254: v1(63.22,19.63) 63.78,19.07 C15.2 64.83,17.94 U1.16 ; v1(89.38,91.28) 91.18,91.28 U26.5 ; U25.5 138.86,71.62 v1(138.98,71.5) ; v1(16.7,68.8) 15.9,69.6 14.48,69.6 13.93,69.05 U24.5 ; U23.5 55.85,92.8 55.55,92.5 55.55,90.68 v1(55.48,90.6) ; v1(84.66,46.81) 85.89,48.04 C13.2 ; U3.16 88.08,13.77 v1(88.15,13.7) ; v1(65.66,53.42) 65.8,53.56 C8.2
  Bottom Layer w0.381: v1(73.13,53.56) 73.13,55.39 L1.1
  Bottom Layer w0.508: C5.2 81.86,53.56 C4.2 v1(78.92,53.56) C11.2 78.13,53.56 R3.2 ; C13.2 C17.2 C19.2
  vias: v1(31.69,42.27) v1(32.55,54.97) v1(32.76,48.35) v1(37.57,48.78) v1(76.68,52.06) v1(109.42,26.14) v1(109.71,80.9) v1(109.71,78.85) v1(138.16,84.24)
5V_IN: length 8.2
  Top Layer w0.254: D5.2 37.41,16.89 38,17.47 41.45,17.47 42.34,16.59 42.34,15 USB1.1
+5V: length 18.2
  Top Layer w0.635: v1(47.08,49.4) 47.08,52.83 v1(47.98,53.73) 49.68,52.03 U4.3
  Bottom Layer w0.254: C57.1 98,96.36 CN9.3 ; C53.1 9.47,74.97 CN7.3 ; CN6.3 51.43,95.93 C51.1 ; 142.51,76.85 142.36,77 CN8.3
  vias: v1(13.75,94.88) v1(15.88,75.53) v1(15.9,72.52) v1(24.06,11.76) v1(27.68,14.07) v1(28.66,82.75) v1(29.95,74.09) v1(29.95,73.33) v1(30.71,74.09) v1(30.71,73.33) v1(32.52,5.46) v1(37.41,12.41) v1(60.38,98.55) v1(60.38,95.48) v1(89.35,99.35) v1(89.35,96.28) v1(132.1,102.3) v1(133.63,78.42) v1(133.73,75.5) v1(136.98,101.63) v1(138.03,92.58)
+16V: length 29.4
  Top Layer w0.254: R9.2 60.51,51.21 60.43,51.29 60.43,51.31 59.89,51.84 v1(59.28,51.84)
  Top Layer w0.635: U37.7 39.99,82.93 39.99,81.56 39.94,81.51 39.91,81.51
  Bottom Layer w0.254: U27.7 43.08,64.39 44.14,63.32 47.8,63.32 v1(59.28,51.84)
  vias: v1(38.68,87.6) v1(38.68,86.69) v1(39.97,81.51) v1(48.84,76.11)
GND: length 64.6
  Top Layer w0.254: U13.74 80.54,40.41 80.54,39.22 ; v1(64.26,53.62) 64.87,54.23 65.92,54.23 66.58,53.57 67.38,53.57 U13.27 ; U13.10 76.5,53.18 73.63,50.32 73.63,48.64 72.36,47.37 70.81,47.37 v1(70.4,47.79) ; 71.96,56.92 71.96,56.77 71.57,56.38 71.57,55.62 U13.20 ; U13.99 83.31,53.5 83.63,53.82 83.63,54.22 83.92,54.51 ; 41.37,81.51 v1(41.37,83.31)
  Top Layer w0.381: C39.1 23.04,25.88 23.62,25.3 23.62,22.85 U19.3
  Bottom Layer w0.254: v1(57.71,24.67) 58.8,24.67 58.83,24.7 61.23,24.7 ; 7.45,76.38 9.5,78.42 CN7.1 ; CN6.1 54.08,94.42 C52.1 ; RN4.8 RN4.7 RN4.6 RN4.5 ; C56.1 140.5,71.62 CN8.1 142.48,74.98 C55.2 ; 80.16,17.02 80.16,15.07 ; U1.8 71.82,13.22 v1(72.19,13.59) ; RN6.8 RN6.7 RN6.6 RN6.5
  Bottom Layer w0.508: C18.2 74.9,52.16 C6.1 73.08,52.11 C2.1 71.37,52.13 C1.1 69.6,52.16 C8.1 ; C11.1 C4.1 81.86,52.16 C5.1
  vias: v1(7.95,91.78) v1(12.15,92.4) v1(13.93,70.6) v1(15.88,76.83) v1(15.9,73.82) v1(16.7,70.2) v1(28.57,81.05) v1(32.47,2.51) v1(35.09,82.3) v1(37.79,81.66) v1(43.51,87.15) v1(47.08,48) v1(47.98,58.59) v1(47.98,57.89) v1(48.84,70.2) v1(50.03,96.48) v1(51.2,82.62) v1(54.28,49.69) v1(55.85,59.13) v1(56.7,47.87) v1(59.72,40.79) v1(60.38,99.85) v1(60.38,96.78) v1(60.64,45.41) v1(63.14,38.68) v1(64.82,20.5) v1(80.54,36.22) v1(81.3,36.22) v1(81.74,24.08) v1(81.74,23.32) v1(81.74,22.55) v1(88.29,54.84) v1(89.35,98.05) v1(89.35,94.98) v1(89.38,89.88) v1(89.55,13.7) v1(93.55,91.35) v1(96.43,96.53) v1(109.81,83.22) v1(112.87,27.23) v1(113.23,79.08) v1(115.76,83.2) v1(117.53,84.05) v1(119.75,84.38) v1(119.9,78.63) v1(125.91,84.38) v1(126.06,78.63) v1(131.93,98.95) v1(133.71,91.58) v1(133.73,74.2) v1(134.93,71.62) v1(135.81,95.15) v1(136.6,87.77) v1(136.98,100.33) v1(138.06,94.43) v1(138.16,82.94)
VDDA: length 12.8
  Top Layer w0.254: R2.2 69.16,59.94 69.16,59.18 69.72,58.62 70.08,58.62 70.51,58.19 70.51,55.56 U13.22 70.57,55.48 70.57,54.72 71.37,53.93 v1(71.37,53.53)
  Bottom Layer w0.381: C2.2 71.59,53.72 L1.2
  Bottom Layer w0.508: C1.2 v1(71.37,53.53) C2.2
ADC_BAT: length 9
  Top Layer w0.254: U13.36 67.42,48.97 R9.1
  Top Layer w0.381: R9.1 62.07,48.92 R12.2 62.04,47.24 C41.2
ADC_CAP: length 160.8
  Top Layer w0.254: U13.35 63.05,49.5 v1(61.01,51.54) ; v1(58.24,56.36) 58.24,60.22 56.46,62 42.14,62 39.47,59.33 39.47,46.13 37.96,44.61 R28.1 ; 136.59,83.59 137.29,84.29 137.29,85.07 R18.1 138.04,87.73 C40.2 ; D1.3 135.48,82.51 135.48,81.33 123.95,69.8 v1(61.09,69.8)
  Bottom Layer w0.254: v1(61.09,69.8) 61.01,69.72 v1(61.01,51.54) 58.24,54.3 v1(58.24,56.36)
BOOT0: length 43.2
  Top Layer w0.254: v1(79.12,44.98) 79.12,44.3 v1(78.23,43.41) ; v1(83.85,37.9) 83.85,39.85 v1(83.57,40.13) ; v1(79.12,48.36) 79.12,49.81 80.31,51 U13.94
  Bottom Layer w0.254: v1(78.23,43.41) 80.29,43.41 v1(83.57,40.13) ; v1(83.85,37.9) 83.85,20.01 84.66,19.2 RN5.4 ; v1(79.12,48.36) v1(79.12,44.98)
BUZZER: length 34.4
  Top Layer w0.254: v1(64.31,54.89) 64.24,54.97 60.93,54.97 58.34,52.37 58.34,44.22 59.33,43.23 59.33,42.01 59.97,41.38 62.14,41.38 R8.1 ; U13.16 73.5,57 v1(72.69,57.81)
  Bottom Layer w0.254: v1(64.31,54.89) 67.79,54.89 70.71,57.81 v1(72.69,57.81)
CAP_VIN: length 3.6
  Top Layer w0.254: R18.2 135.46,86.89 H2.1
CE: length 47.3
  Top Layer w0.254: U13.83 103.9,45.5 107.21,42.19 108.51,42.19 109.53,41.17 109.53,39.88 120.49,28.91 U7.2
CHG_EN: length 93.7
  Top Layer w0.254: v1(90.07,51.84) 98.73,60.5 v1(129.72,60.5) ; v1(65.33,50.27) 65.56,50.5 U13.33
  Bottom Layer w0.254: v1(65.33,50.27) 88.49,50.27 v1(90.07,51.84) ; v1(129.72,60.5) 129.72,78.19 H2.5
CHIP: length 67.8
  Top Layer w0.254: v1(110.73,86.95) 114.85,86.95 R23.1 ; U13.26 66.65,54 64.89,55.76 v1(64.89,57.04)
  Bottom Layer w0.254: v1(64.89,57.04) 64.89,58.26 68.03,61.4 83.55,61.4 109.1,86.95 v1(110.73,86.95)
CHIP_OUT: length 4.9
  Top Layer w0.254: U9.4 130.78,86.92 H2.2
CSN: length 45
  Top Layer w0.254: U7.3 119.22,28.8 108.23,39.79 106.56,39.79 101.35,45 U13.82
ENCODER_A1: length 46.8
  Top Layer w0.254: v1(58.15,93.68) 58.15,64.12 63.96,58.32 68.35,58.32 70,56.67 U13.23
  Bottom Layer w0.254: v1(58.15,93.68) 57.08,93.68 U23.6
ENCODER_A2: length 81.4
  Top Layer w0.254: U13.77 81.79,42.5 81.76,42.46 v1(78.75,42.46)
  Bottom Layer w0.254: v1(78.75,42.46) 77.77,42.46 77.44,42.8 73.93,42.8 73.59,42.46 64.93,42.46 47.05,60.35 19.5,60.35 12.95,66.9 12.95,68.28 U24.6
ENCODER_A3: length 63.2
  Top Layer w0.254: U13.92 87.4,50 99.1,61.7 128.36,61.7 v1(137.23,70.57)
ENCODER_A4: length 59.3
  Top Layer w0.254: U13.31 64.3,51.5 v1(61.88,53.92)
  Bottom Layer w0.254: U26.6 91.21,92.25 87.5,92.25 61.9,66.65 61.9,53.94 v1(61.88,53.92)
ENCODER_B1: length 45.1
  Top Layer w0.254: v1(57.08,91.03) 57.08,62.92 62.3,57.7 68.41,57.7 69.5,56.61 U13.24
  Bottom Layer w0.254: v1(57.08,91.03) 57.08,91.78 U23.4
ENCODER_B2: length 79.7
  Top Layer w0.254: v1(77.33,47.64) 80.69,47.64 81.49,48.43 82.48,48.43 82.55,48.5
  Bottom Layer w0.254: U24.4 21.58,61.6 46.5,61.6 64.26,43.84 73.53,43.84 v1(77.33,47.64)
ENCODER_B3: length 63.8
  Top Layer w0.254: v1(137.23,72.57) 133.68,72.57 123.73,62.62 99.3,62.62 87.18,50.5 U13.93
ENCODER_B4: length 58.2
  Top Layer w0.254: v1(62.75,51.86) 63.61,51 U13.32
  Bottom Layer w0.254: U26.4 91.26,89.23 90.05,88.03 85.35,88.03 62.75,65.42 v1(62.75,51.86)
IR_BALL_DECT: length 88.3
  Top Layer w0.254: U13.15 74,57.64 v1(74.17,57.81) ; 131.93,96.35 132.15,96.13 R20.2 131.7,94.23 v1(130.58,94.23)
  Bottom Layer w0.254: v1(130.58,94.23) 128.64,94.23 124.51,90.09 124.51,80.06 120.83,76.38 99.87,76.38 83.86,60.37 83.03,60.37 82.02,59.36 82.02,56.97 80.95,55.9 79.28,55.9 79.1,56.08 79.1,58.42 78.79,58.72 75.08,58.72 v1(74.17,57.81)
IR_PWM: length 108.7
  Top Layer w0.254: R17.1 14.2,92.43 19.99,92.43 20.73,91.69 v1(20.85,91.69) ; v1(84.38,51.48) 84.36,51.5 U13.95 ; v1(81.51,70.97) v1(59.82,70.97) ; v1(83.24,59.33) 83.24,61.67 81.49,63.42 81.49,68.42 v1(81.48,68.43)
  Bottom Layer w0.254: v1(81.48,68.43) 81.48,70.94 v1(81.51,70.97) ; v1(83.24,59.33) 84.38,58.19 v1(84.38,51.48) ; v1(20.85,91.69) 21.49,91.06 21.49,74.12 24.64,70.97 v1(59.82,70.97)
IRQ: length 41.7
  Top Layer w0.254: U7.7 114.14,28.35 113.31,29.18 110.7,29.18 109.35,27.83 ; 109.37,27.45 106.71,27.45 106.7,27.46 105.84,27.46 91.62,41.68 91.62,43.36 90.47,44.5 U13.81
JATG_SWDCLK: length 30.2
  Top Layer w0.254: U13.76 82.62,41.93 82.62,35 ; 82.62,35 71.52,35 71.17,34.64 68.83,34.64 66.68,32.49 U32.4 ; 82.62,35 82.62,32.4 81.64,31.42 81.64,29.78 R54.2
JATG_SWDIO: length 29
  Top Layer w0.254: R1.2 65.33,38.68 v1(65.86,38.15) ; U32.5 65.44,34.14 67.37,34.14 68.89,35.66 77.47,35.66 78.92,37.11 78.92,39.11 79.43,39.62 79.43,40.38 U13.72
  Bottom Layer w0.381: U32.5 63.78,32.5 63.78,34.19 65.86,36.27 v1(65.86,38.15)
LED_CLK: length 59.7
  Top Layer w0.254: U13.30 67.42,51.97 66.27,51.97 65.89,52.35 v1(64.59,52.35) ; R41.1 40.48,32.92 43.97,32.92 45.47,34.42 45.47,40.92 v1(45.5,40.96) ; v1(63.86,46.38) 63.78,46.3 63.78,45.11 62.69,44.02 v1(59.89,44.02)
  Bottom Layer w0.254: v1(45.5,40.96) 45.5,41.16 48.36,44.02 v1(59.89,44.02) ; v1(63.86,46.38) 63.86,51.61 v1(64.59,52.35)
LED_COMM: length 66
  Top Layer w0.254: v1(127.79,23.54) 130.9,23.54 R13.1 ; v1(77.09,39.12) 77,39.2 U13.67
  Bottom Layer w0.254: v1(127.79,23.54) 125.83,21.59 96.93,21.59 85.45,33.07 85.45,37.57 83.9,39.12 v1(77.09,39.12)
LED_DAT: length 72.5
  Top Layer w0.254: v1(48.03,41.35) 46.28,39.6 46.28,33.81 44.48,32 41.32,32 R40.1 ; v1(80.01,46.35) 79.91,46.46 76.86,46.46 76.38,45.97 76.38,43.76 74.93,42.32 74.27,42.32 v1(74.17,42.21) ; U13.91 81.1,49.5 v1(80.09,48.49)
  Bottom Layer w0.254: v1(48.03,41.35) 48.29,41.6 73.56,41.6 v1(74.17,42.21) ; v1(80.01,46.35) 80.09,46.43 v1(80.09,48.49)
LED_PWR: length 63.9
  Top Layer w0.254: U13.57 72,38.19 70.81,37.01 60.96,37.01 57.52,33.56 46.85,33.56 44.58,31.29 41.66,31.29 31.06,20.7 31.06,13.44 30.75,13.12 Q3.1 28.52,11.76 25.57,11.76
MISO: length 42.7
  Top Layer w0.254: U7.6 115.41,25.72 114.25,24.56 107.49,24.56 88.55,43.5 U13.79
MOSI: length 41.8
  Top Layer w0.254: U13.80 89.32,44 v1(89.48,43.84) ; U7.5 116.76,27.31 116.76,28.27 113.44,31.6 108.69,31.6 97.56,42.73 v1(93.22,42.73)
  Bottom Layer w0.254: v1(89.48,43.84) 92.11,43.84 v1(93.22,42.73)
MOTOR_BRK1: length 56
  Top Layer w0.254: v1(69.7,58.04) 69.32,58.04 68.5,58.85 64.19,58.85 58.8,64.24 v1(58.8,65.4) ; v1(79.98,56.92) 80,56.91 U13.3
  Bottom Layer w0.254: v1(58.8,65.4) 57.28,66.93 34.85,66.93 U27.3 ; v1(79.98,56.92) 79.98,58.29 78.87,59.41 71.17,59.41 69.8,58.04 v1(69.7,58.04)
MOTOR_BRK2: length 33.8
  Top Layer w0.254: U13.38 67.38,47.93 66.29,47.93 65.61,47.24 v1(63.19,47.24) ; v1(59.21,46.84) 59.21,50.52 v1(59.52,50.83)
  Bottom Layer w0.254: v1(59.52,50.83) 60.17,50.83 63.19,47.8 v1(63.19,47.24) ; v1(59.21,46.84) 47.92,46.84 U28.3
MOTOR_BRK3: length 35.2
  Top Layer w0.254: v1(91.12,59.75) 91.12,59.7 89.18,57.76 79.86,57.76 79,56.9 U13.5
  Bottom Layer w0.254: v1(91.12,59.75) 98.16,59.75 106.83,51.08 U29.3
MOTOR_BRK4: length 48.9
  Top Layer w0.254: v1(104.62,59.41) 104.67,59.36 104.67,56.62 103.99,55.93 95.02,55.93 91.21,52.12 v1(91.21,51.94) ; v1(75.97,49.35) 79.55,52.93 79.55,55.5 U13.4
  Bottom Layer w0.254: v1(75.97,49.35) 83.26,49.35 83.62,49.71 88.98,49.71 v1(91.21,51.94) ; U30.3 106.92,64.55 104.62,62.25 v1(104.62,59.41)
MOTOR_BRK5: length 25.9
  Top Layer w0.254: v1(65.75,56.15) 67.27,54.64 68.07,54.64 68.76,53.95 68.76,47.75 68.51,47.5 U13.39
  Bottom Layer w0.254: v1(65.75,56.15) 64.32,56.15 64.06,56.41 64.06,61.82 65.51,63.27 68.19,63.27 U31.3
MOTOR_DIR1: length 81.6
  Top Layer w0.254: v1(85.78,53.29) 84.3,53.29 83.51,52.5 U13.97 ; v1(59.36,69.09) 84.76,69.09 86.56,67.28 86.56,64.11 84.78,62.33 v1(84.78,60.27)
  Bottom Layer w0.254: U27.1 27.64,65.2 27.64,67.51 29.21,69.09 v1(59.36,69.09) ; v1(84.78,60.27) 84.78,60.02 84.76,59.99 85.78,58.98 v1(85.78,53.29)
MOTOR_DIR2: length 65.5
  Top Layer w0.254: v1(81.01,57.02) 81.01,56.81 80.5,56.31 U13.2 ; v1(63.65,55.8) 63.63,55.78 56.92,55.78 56.34,56.36 47.65,56.36 45.97,54.69 45.97,52.55 43.18,49.76 41.05,49.76 39.95,48.67 39.95,37.46 41.58,35.84 U28.1
  Bottom Layer w0.254: v1(63.65,55.8) 63.98,55.47 64.55,55.47 64.63,55.4 66.08,55.4 70.68,59.99 79.43,59.99 81.01,58.41 v1(81.01,57.02)
MOTOR_DIR3: length 31.6
  Top Layer w0.254: U13.1 81,56.01 81.91,56.92 89.1,56.92 91.09,58.9 v1(91.27,58.9) ; v1(102.62,54.02) 105.86,54.02 U29.1
  Bottom Layer w0.254: v1(91.27,58.9) 91.35,58.98 97.67,58.98 v1(102.62,54.02)
MOTOR_DIR4: length 26.8
  Top Layer w0.254: U13.98 83.4,53 84.48,54.08 89.66,54.08 v1(92.51,56.92) ; v1(96.77,57.12) 96.8,57.12 99.54,59.87 v1(101.02,59.87)
  Bottom Layer w0.254: v1(96.77,57.12) 92.71,57.12 v1(92.51,56.92) ; U30.1 101.02,64.18 v1(101.02,59.87)
MOTOR_DIR5: length 23.8
  Top Layer w0.254: v1(67.84,60.02) 64.84,63.02 U31.1 ; U13.41 68.83,46.5 69.24,46.91 69.24,53.97 66.16,57.05 v1(65.76,57.05)
  Bottom Layer w0.254: v1(65.76,57.05) 65.76,57.94 v1(67.84,60.02)
MOTOR_PWM1: length 47.4
  Top Layer w0.254: v1(64.97,45.52) 65.97,45.52 66.37,45.92 66.37,46.68 66.62,46.93 67.38,46.93 U13.40
  Bottom Layer w0.254: v1(64.97,45.52) 63.63,45.52 46.53,62.61 30.81,62.61 30.28,63.14 30.28,64.9 U27.2
MOTOR_PWM2: length 28.9
  Top Layer w0.254: U13.45 66.69,44.5 64.46,42.27 v1(63.7,42.27) ; v1(58.09,42.29) 57.91,42.11 44.91,42.11 43.33,40.54 43.33,39.12 42.8,38.58 42.2,38.58 U28.2
  Bottom Layer w0.254: v1(63.7,42.27) 63.68,42.24 58.14,42.24 v1(58.09,42.29)
MOTOR_PWM3: length 50.1
  Top Layer w0.254: v1(102.72,52.55) 106.93,52.55 U29.2 ; v1(91.39,57) 91.39,56.31 90.58,55.5 82.78,55.5 82.32,55.04 82.32,55.03 81.47,54.18 81.47,52.9 73.58,45 U13.44
  Bottom Layer w0.254: v1(91.39,57) 92.61,58.22 97.05,58.22 97.16,58.11 97.3,58.11 97.64,57.77 97.64,57.63 v1(102.72,52.55)
MOTOR_PWM4: length 46.1
  Top Layer w0.254: U30.2 102.63,63.25 96.67,63.25 89.87,56.44 82.17,56.44 81.48,55.75 81.48,54.69 80.9,54.11 80.9,52.96 73.94,46 U13.42
MOTOR_PWM5: length 34.6
  Top Layer w0.254: v1(83.97,59.74) 83.97,66.67 v1(83.92,66.72) ; U13.96 83.72,52 84.18,52.45 v1(85.01,52.45)
  Bottom Layer w0.254: U31.2 69.1,66.72 v1(83.92,66.72) ; v1(85.01,52.45) 85.01,58.7 v1(83.97,59.74)
NRST: length 55.8
  Top Layer w0.254: v1(78.26,45.76) 79.69,45.76 80.14,45.31 80.14,44.68 v1(81,43.81) ; U13.14 74.5,53.95 v1(74.94,53.52) 72.36,50.94 v1(72.36,48.95)
  Top Layer w0.381: v1(74.8,28.52) 84.48,28.52 85.4,29.44 v1(85.4,41.12)
  Bottom Layer w0.254: v1(72.36,48.95) 72.8,48.51 77.88,48.51 78.26,48.13 v1(78.26,45.76) ; v1(85.4,41.12) 82.7,43.81 v1(81,43.81)
  Bottom Layer w0.381: U32.2 71.29,31.99 74.75,28.52 v1(74.8,28.52)
  Bottom Layer w0.508: R3.1 76.59,53.52 v1(74.94,53.52)
SCK: length 46.6
  Top Layer w0.254: U13.78 87.76,43 107.65,23.11 116,23.11 117.95,25.06 U7.4
SCL: length 30.5
  Top Layer w0.254: U13.47 74.18,43.5 v1(74.93,44.25)
  Bottom Layer w0.254: v1(74.93,44.25) 79.81,44.25 80.49,44.93 83.44,44.93 89.13,39.24 89.13,33.93 89.46,33.6 U38.3
SDA: length 33.5
  Top Layer w0.254: U13.48 74.84,43 75.72,43.88 75.72,46.36 76.41,47.05 80.94,47.05 v1(80.97,47.09) ; v1(87.07,42.34) 87.07,39.7 v1(87.05,39.67)
  Bottom Layer w0.254: U38.4 v1(87.05,39.67) ; v1(80.97,47.09) 82.32,47.09 v1(87.07,42.34)
SHOOT: length 60.1
  Top Layer w0.254: v1(110.81,77.44) 111.48,78.12 111.48,78.63 R25.1 112.43,80.03 U12.2 ; v1(66.97,57.11) 68.27,57.11 69,56.37 U13.25
  Bottom Layer w0.254: v1(66.97,57.11) 66.97,57.92 69.77,60.72 83.56,60.72 100.28,77.44 v1(110.81,77.44)
SHOOT_2: length 1.7
  Top Layer w0.254: U12.4 115.88,79.12 R29.1
SHOOT_OFF: length 63.4
  Top Layer w0.254: v1(49.38,42.93) 43.99,42.93 43.15,42.09 v1(40.69,42.09) ; U13.7 78,52.21 72.4,46.61 v1(70.33,46.61) ; U10.4 31.81,50.25 31.62,50.06 31.62,44.83 33.24,43.21 R27.1 35.31,42.27 R26.2 35.34,41.55 35.97,40.92 37.8,40.92 v1(38.89,42.01) ; v1(65.15,44.5) 63.68,43.03 v1(61.06,43.03)
  Bottom Layer w0.254: v1(38.89,42.01) 38.96,42.09 v1(40.69,42.09) ; v1(65.15,44.5) 68.22,44.5 v1(70.33,46.61) ; v1(49.38,42.93) 49.48,43.03 v1(61.06,43.03)
SHOOT_OUT: length 6.1
  Top Layer w0.254: U11.4 127.62,81.17 H2.4
SW_CLK: length 55.7
  Top Layer w0.254: v1(74.27,36.8) 74.27,37.72 76,39.45 U13.65
  Bottom Layer w0.254: 81.55,14.42 81.85,14.12 81.85,12.95 81.62,12.72 68.8,12.72 68.28,13.25 68.28,16.52 68.88,17.12 U1.2 ; 81.55,14.42 81.99,14.42 83.11,15.54 83.11,24.89 82.58,25.43 79.43,25.43 74.93,29.92 74.93,33.5 74.29,34.14 74.29,36.78 v1(74.27,36.8) ; 81.55,14.42 80.16,14.42
SW_D: length 35.2
  Top Layer w0.254: v1(75.11,37.13) 76.5,38.53 U13.66 ; v1(66.88,19.99) 66.88,26.36 68.76,28.24 72.87,28.24 75.29,30.66 v1(75.29,34.31)
  Bottom Layer w0.254: v1(75.11,37.13) 75.11,34.49 v1(75.29,34.31) ; U1.9 64.67,13.22 65.54,13.22 66.89,14.56 66.89,19.98 v1(66.88,19.99)
SW_LD: length 41.1
  Top Layer w0.254: v1(72.9,34.34) 72.6,34.05 72.6,30.75 72.64,30.71 v1(72.64,29.21) ; v1(72.85,37.19) 73,37.19 75.5,39.69 U13.64
  Bottom Layer w0.254: v1(72.85,37.19) 72.85,34.39 v1(72.9,34.34) ; 80.16,13.77 80.14,13.75 79.08,13.75 77.88,14.94 77.88,18.34 77.7,18.52 77.7,18.52 76.67,19.55 73.39,19.55 71.61,17.77 U1.1 69.88,17.77 69.22,18.44 69.22,24.33 72.64,27.76 v1(72.64,29.21)
UD+: length 7.3
  Top Layer w0.254: USB1.3 43.61,19.15 44.65,20.19 U16.1
UD-: length 9
  Top Layer w0.254: USB1.2 42.96,19.97 44.35,21.36 46.2,21.36 U16.2
USART_RX: length 48.8
  Top Layer w0.254: U13.69 78,40.4 77.98,40.38 77.98,38.2 76,36.22 61.16,36.22 57.68,32.74 47.14,32.74 43,28.6 43,23.67 42.06,22.73 U16.6
USART_TX: length 54.5
  Top Layer w0.254: U13.68 v1(77.5,41.91) ; U16.7 42.42,21.46 v1(43.05,22.1)
  Bottom Layer w0.254: v1(77.5,41.91) 75.41,41.91 74.4,40.89 62.71,40.89 61.82,40 47.65,40 43.59,35.94 43.59,22.63 v1(43.05,22.1)
$1N4438: length 12
  Top Layer w0.254: U13.21 71,56.95 v1(71.12,57.07) 71.12,58.45 R2.1
  Bottom Layer w0.254: C10.2 76.59,55.88 C7.2 75.88,57.07 v1(71.12,57.07)
$1N4971: length 3.7
  Top Layer w0.254: 61.6,40.49 61.63,40.46 R11.2 61.59,38.72 U8.1
$1N5079: length 5.7
  Top Layer w0.254: BUZZER1.2 55.49,37.44 U8.3
$1N5182: length 7.9
  Top Layer w0.254: C16.2 73.98,60.97 X1.1 75,59.96 U13.13
$1N5208: length 9.1
  Top Layer w0.254: C14.2 81.29,61.16 80.34,61.16 79.27,60.1 X1.2 75.5,56.84 U13.12
$1N14140: length 6.2
  Top Layer w0.254: U13.49 68.42,42.5 68.68,42.24 68.68,41.53 68.22,41.07 68.22,39.04 68.58,38.68 v1(68.58,37.73)
$1N14147: length 13.9
  Top Layer w0.254: U13.73 80,38.82 v1(81.1,37.72)
  Bottom Layer w0.254: C9.2 70.59,37.86 80.91,37.86 81.05,37.72 v1(81.1,37.72)
$1N22834: length 2.1
  Top Layer w0.254: v1(65.46,48.15) 65.81,48.5 U13.37
$1N48575: length 2.2
  Top Layer w0.254: R13.2 132.55,23.4 LED2.1
$1N48580: length 2.5
  Top Layer w0.254: R10.2 34.1,5.39 34.1,2.95
$2N127: length 3.3
  Top Layer w0.254: 119.75,86.92 119.68,86.85 R23.2
$2N711: length 2.6
  Top Layer w0.254: U11.1 119.36,80.63 R29.2
$2N10692: length 6.2
  Top Layer w0.254: R24.1 113.16,80.9 U12.1 113.16,81.05 D3.1 113.13,83.22 C28.2
$2N13663: length 9.6
  Top Layer w0.254: R30.1 R31.2 35.92,52.1 35.1,51.28 35.1,50.29 U10.3 36.93,50.25 C29.2
$2N14038: length 9
  Top Layer w0.254: R26.1 36.85,42.86 36.3,43.41 34.24,43.41 34.06,43.59 34.06,45 35.18,46.12 35.18,48.23 U10.1
$2N20737: length 2.3
  Top Layer w0.254: U16.8 40.72,20.14 C37.1
$2N27734: length 7.9
  Top Layer w0.254: v1(73.84,21.68) 71.19,24.32 SW2.8
  Bottom Layer w0.254: RN4.4 73.85,21.7 v1(73.84,21.68) 73.84,20.68 RN3.5
$2N27735: length 6.7
  Top Layer w0.254: v1(59.63,21.97) 59.63,22.6 58.81,23.42 58.81,26.38 SW1.7
  Bottom Layer w0.254: RN2.3 v1(59.63,21.97) 59.65,21.95 RN1.2
$2N27736: length 8.1
  Top Layer w0.254: v1(61.23,21.98) 62.39,21.98 63.81,23.4 SW1.5
  Bottom Layer w0.254: RN2.1 v1(61.23,21.98) 61.25,21.95 RN1.4
$2N27737: length 8.1
  Top Layer w0.254: SW1.8 56.31,26.32 56.31,23.34 57.69,21.96 v1(58.82,21.96)
  Bottom Layer w0.254: RN2.4 58.83,21.97 v1(58.82,21.96) 58.85,21.93 RN1.1
$2N27739: length 8.7
  Bottom Layer w0.254: U1.11 64.61,14.47 62.08,14.47 58.85,17.7 RN1.8
$2N27740: length 6.6
  Top Layer w0.254: v1(60.44,21.98) 60.44,22.61 61.27,23.44 SW1.6
  Bottom Layer w0.254: RN2.2 60.44,22.89 v1(60.44,21.98) 60.45,21.97 RN1.3
$2N27741: length 5
  Bottom Layer w0.254: RN3.4 73.83,17.82 72.48,16.47 U1.3
$2N27742: length 6.1
  Bottom Layer w0.254: RN3.3 74.63,17.87 72.58,15.82 U1.4
$2N27743: length 7.1
  Bottom Layer w0.254: RN3.2 75.43,17.92 72.68,15.17 U1.5
$2N27744: length 6.6
  Bottom Layer w0.254: RN5.2 90.65,18.02 89,16.37 U3.12
$2N27748: length 5.2
  Bottom Layer w0.254: U1.14 62.93,16.47 61.25,18.15 RN1.5
$2N27749: length 6.4
  Bottom Layer w0.254: U1.13 62.63,15.82 60.45,18 RN1.6
$2N27750: length 7.5
  Bottom Layer w0.254: U1.12 64.64,15.15 62.4,15.15 59.65,17.9 RN1.7
$2N27755: length 28.8
  Top Layer w0.254: v1(84.33,18.26) 83.01,18.26 81.38,19.89 70.87,19.89 64.85,13.87 v1(62.46,13.87)
  Bottom Layer w0.254: U1.10 64.66,13.87 v1(62.46,13.87) ; v1(84.33,18.26) 84.39,18.32 U3.9
$2N27763: length 7.9
  Top Layer w0.254: SW2.5 78.81,24.17 v1(76.33,21.69)
  Bottom Layer w0.254: RN3.8 76.33,20.77 v1(76.33,21.69) 76.33,22.6 RN4.1
$2N27764: length 7.1
  Top Layer w0.254: v1(75.44,21.69) 75.44,22.33 76.27,23.16 SW2.6
  Bottom Layer w0.254: RN3.7 75.43,21.68 v1(75.44,21.69) 75.45,21.71 RN4.2
$2N27765: length 7.2
  Top Layer w0.254: SW2.7 73.73,23.27 74.68,22.32 v1(74.68,21.71)
  Bottom Layer w0.254: RN3.6 74.68,20.72 v1(74.68,21.71) 74.68,22.65 RN4.3
$2N27769: length 8.2
  Bottom Layer w0.254: U1.6 72.78,14.52 76.23,17.97 RN3.1
$2N27770: length 7.6
  Bottom Layer w0.254: U3.13 85.92,15.75 88.98,15.75 91.45,18.22 RN5.1
$2N27775: length 7.1
  Top Layer w0.254: SW3.7 88.73,23.85 89.9,22.67 89.9,22.15 v1(89.85,22.09)
  Bottom Layer w0.254: RN5.6 89.85,22.08 v1(89.85,22.09) 89.85,22.1 RN6.3
$2N27779: length 7.8
  Top Layer w0.254: SW3.8 86.19,24.91 v1(89.06,22.05)
  Bottom Layer w0.254: RN5.5 89.06,21 v1(89.06,22.05) 89.06,23.17 RN6.4
$2N27783: length 7.5
  Top Layer w0.254: v1(91.47,22.06) 93.81,24.4 SW3.5
  Bottom Layer w0.254: RN6.1 91.47,23.15 v1(91.47,22.06) 91.45,22.04 RN5.8
$2N27787: length 6.8
  Top Layer w0.254: SW3.6 91.27,23.36 90.66,22.75 v1(90.66,22.08)
  Bottom Layer w0.254: RN5.7 90.65,22.08 v1(90.66,22.08) 90.66,23.17 RN6.2
$2N27794: length 5.6
  Bottom Layer w0.254: U3.11 89,17.02 89.85,17.87 RN5.3
$2N28091: length 24.2
  Top Layer w0.254: Q3.2 29.84,14.99 26.01,14.99 24.61,13.59 20.45,13.59 20.05,13.99 R38.2
  Top Layer w0.381: R38.2 R39.2 20.05,22.04 19.43,22.66 U19.4 18.63,24.21 C39.2
$2N28095: length 8.8
  Top Layer w0.254: R41.2 27.06,21.06 U19.2
  Top Layer w0.381: R39.1 21.72,17.36 21.72,20.22 22.56,21.06 U19.2
$2N28096: length 8.5
  Top Layer w0.254: R40.2 26.91,19.46 U19.1
  Top Layer w0.381: R38.1 23.43,17.32 U19.1
$2N33694: length 20
  Top Layer w0.381: U37.8 36.2,85.8 35.6,85.8
  Top Layer w0.635: U37.8 42.56,84.2 D17.1
  Top Layer w1.016: L3.1 44.14,74.29 D17.1
$2N33704: length 4.3
  Top Layer w0.254: 32.39,80.39 32.31,80.31 30.85,80.31 R57.1 30.17,81.1 R58.1
$2N33708: length 2.8
  Top Layer w0.381: C67.1 33.99,85.8 32.39,84.2
$3N2149: length 6
  Top Layer w0.254: R14.2 11.25,98.93 U33.1
$3N2150: length 6.3
  Top Layer w0.254: 10.38,92.73 10.38,95.59 U33.2
$3N2153: length 3.8
  Top Layer w0.254: 10.38,90.83 12.13,90.83 R19.2 14.13,90.85 R17.2
$3N2156: length 6.6
  Top Layer w0.254: U6.2 132.88,99.8 R21.1 132.25,100.55 133.67,101.97 133.67,102.24 ; R15.1 134.06,102.3 D2.3
$3N2158: length 7
  Top Layer w0.254: R16.1 139.54,94.34 C24.1
  Top Layer w0.381: C24.1 139.73,94.69 139.73,97.79 140.86,98.93 U34.3
$3N2160: length 3.7
  Top Layer w0.254: LED3.2 133.66,93.12 R20.1
$3N2176: length 11.3
  Top Layer w0.381: R21.2 136.07,98.12 v1(137.9,98.12)
  Bottom Layer w0.381: U34.1 141.75,96.19 140.74,96.19 138.81,98.12 v1(137.9,98.12)
$3N2966: length 4.4
  Bottom Layer w0.254: CN6.2 53.83,96.33 R46.2
$3N2970: length 11
  Bottom Layer w0.254: CN6.4 48,97.25 49.15,98.4 R47.2
$3N3098: length 4.3
  Bottom Layer w0.254: U23.1 58.78,94.27 D7.3 57.38,96.13 57.18,96.33
$3N3102: length 18.6
  Bottom Layer w0.254: U23.3 60.7,91.85 61.41,92.56 61.41,100.4 60.65,101.15 58.48,101.15 57.23,99.9 R47.1 57.98,98.4 D8.3
$3N3909: length 7.7
  Bottom Layer w0.254: U24.1 12.1,71.47 12.1,75.42 R48.1 14.22,76.12 D9.3
$3N3912: length 4.3
  Bottom Layer w0.254: U24.3 14.88,72.6 D10.3 14.28,73.15 12.83,73.15
$3N3948: length 2.2
  Bottom Layer w0.254: CN7.2 10.42,77 R48.2
$3N3950: length 1.9
  Bottom Layer w0.254: R49.2 11.17,73 CN7.4
$3N4791: length 8.4
  Bottom Layer w0.254: U26.1 93.3,92.55 93.3,97.97 R52.1 D13.3
$3N4794: length 7.5
  Bottom Layer w0.254: D14.3 92.45,95.63 R53.1 92.5,90.83 92.93,90.4 U26.3
$3N4814: length 7.4
  Bottom Layer w0.254: 134.93,72.65 134.93,74 134.6,74.33 134.6,77.15 D12.3 135.31,77.7 R51.1
$3N4818: length 6.9
  Bottom Layer w0.254: 134.93,70.75 135.38,70.75 136.08,71.45 136.08,74.1 D11.3 R50.1
$3N4824: length 2
  Bottom Layer w0.254: CN8.2 140.35,74.85 R50.2
$3N4826: length 2.4
  Bottom Layer w0.254: CN8.4 139.2,77.7 R51.2
$3N4848: length 9.4
  Bottom Layer w0.254: CN9.2 100,97.53 98.83,98.7 R52.2
$3N4850: length 2.4
  Bottom Layer w0.254: R53.2 94.92,95.58 CN9.4
$3N5998: length 6.7
  Top Layer w0.508: P1.5 38.55,91 38.04,91.52 38.04,91.54 34.58,95 CN10.5
$3N6003: length 6.9
  Top Layer w0.508: P1.6 41.81,91.39 40.25,92.95 38.8,92.95 CN10.6
$3N6008: length 6.8
  Top Layer w0.508: P1.7 42.42,92.93 41.73,92.93 39.65,95 CN10.7
$3N6141: length 4
  Top Layer w0.254: CN11.7 81.35,94.9
  Top Layer w0.508: 81.35,94.9 P2.7
$3N6145: length 4
  Top Layer w0.254: 78.75,91.06 P2.6
  Top Layer w0.508: CN11.6 78.75,91.06
$3N6147: length 4
  Top Layer w0.254: 76.25,91.02 P2.5
  Top Layer w0.508: CN11.5 76.25,91.02
$3N6282: length 6.6
  Top Layer w0.508: P3.7 120.3,92.95 121.2,92.95 CN12.7
$3N6286: length 6.8
  Top Layer w0.508: P3.6 116.25,91 118.28,93.03 119.06,93.03 120.75,94.72 CN12.6
$3N6288: length 6.6
  Top Layer w0.254: P3.5 113.91,91 ; 117.91,95 CN12.5
  Top Layer w0.508: 113.91,91 117.91,95
$3N6423: length 16.1
  Bottom Layer w0.508: CN13.7 13.56,60.69 13.56,54.25 15.47,52.35 P4.7
$3N6427: length 16.2
  Bottom Layer w0.508: CN13.6 12.52,59.23 12.52,52.7 15.42,49.81 P4.6
$3N6429: length 16
  Bottom Layer w0.508: P4.5 15.72,47.27 11.38,51.61 11.38,57.87 CN13.5
$3N6564: length 17.7
  Bottom Layer w0.508: P5.7 142.44,48.09 142.44,52.12 142.08,52.48 141.27,52.48 CN14.7
$3N6568: length 16.6
  Bottom Layer w0.508: P5.6 139.42,47.61 139.42,54.84 139.78,55.2 140.95,55.2 CN14.6
$3N6570: length 16.7
  Bottom Layer w0.508: CN14.5 139.67,57.75 138.23,56.31 138.23,48.96 P5.5

## Copper pours and planes (outline as drawn; the poured copper is in the pictures)
3V3 on Inner2: 0.26,103.74 149.74,103.74 149.74,0.26 0.26,0.26
+5V on Inner1: 0.26,103.74 149.74,103.74 149.74,0.26 0.26,0.26
+16V on Top Layer: 18.06,87.66 20.6,87.66 20.6,77.5 18.06,77.5
+16V on Inner1: 18.31,88.42 126.19,88.42 126.19,39.3 18.31,39.3
GND on Top Layer: -11.15,106.81 156.31,106.81 156.31,-5.08 -11.15,-5.08
GND on Bottom Layer: -11.73,111.07 160.66,111.07 160.66,-4.06 -11.73,-4.06
$3N5979 on Top Layer: 23.32,95.91 23.32,90.73 24.28,89.76 30.25,89.76 30.28,89.79 30.28,92.28 30.23,92.33 27.69,92.33 27.64,92.28 25.93,92.28 25.17,93.04 25.17,95.91
$3N5983 on Bottom Layer: 25.7,96.11 25.7,94.08 30.04,89.75 33.21,89.75 33.27,89.69 33.27,91.41 28.58,96.11
$3N5988 on Top Layer: 28.22,95.93 28.22,93.62 29.02,92.82 31.76,92.82 33.02,91.56 33.02,89.75 35.24,89.75 35.25,89.74 35.25,92.38 31.7,95.94 28.23,95.94
$3N6149 on Top Layer: 69.93,96.34 72.54,96.34 72.54,89.75 69.93,89.75
$3N6153 on Top Layer: 64.44,96.35 67.38,96.35 67.38,89.75 64.44,89.75
$3N6155 on Bottom Layer: 67.49,96.37 69.89,96.37 69.89,89.75 67.49,89.75
$3N6290 on Top Layer: 106.03,90.73 111.94,96.24 114.58,96.24 114.58,93.94 110.32,89.76 106.03,89.76
$3N6294 on Top Layer: 101.11,91.77 101.11,89.95 101.6,89.46 104.17,89.46 109.14,94.43 109.14,96.7 106.04,96.7
$3N6296 on Bottom Layer: 106.97,98.17 104.74,95.94 104.62,95.94 104.62,89.81 104.65,89.79 106.48,89.79 110.08,93.39 111.99,93.39 112.24,93.65 112.24,98.09 112.27,98.12 112.21,98.17
$3N6431 on Top Layer: 7.52,56.54 7.52,54.1 10.77,54.1 11.48,53.39 11.48,48.61 14.02,46.08 14.02,41.96 14.75,41.23 17.7,41.23 17.7,45.75 17.69,45.77 17.69,51.55 12.65,56.59 7.57,56.59
$3N6435 on Top Layer: 7.59,51.18 7.59,37.39 9.39,35.59 17.55,35.59 17.58,35.56 17.58,38.27 12.73,38.27 12.7,38.3 12.7,45.21 10.08,47.83 10.08,51.21 7.62,51.21
$3N6437 on Bottom Layer: 5.92,53.92 5.92,41.86 9.58,38.2 17.7,38.2 17.73,38.23 17.73,40.87 17.78,40.92 10.29,48.41 10.29,53.9 10.26,53.92
$3N6572 on Top Layer: 132.46,51.18 132.46,49.38 133.17,48.67 137.54,48.67 139.75,50.88 139.75,60.4 140.59,61.24 141.73,61.24 142.77,62.28 142.77,63.83 139.47,63.83 137.49,61.85 137.49,53.46 135.21,51.18
$3N6576 on Top Layer: 132.44,53.67 132.44,63.19 138.18,68.94 143.33,68.94 143.33,66.42 140.11,66.42 136.14,62.46 136.14,54.38 135.43,53.67
$3N6578 on Bottom Layer: 143,66.5 137.27,66.5 132.23,61.46 132.23,51.03 135.56,51.03 135.59,51 136.47,51.89 136.47,59.99 140.06,63.58 142.97,63.58 143,63.61

Small or netless copper shapes (teardrops, artwork), in the pictures only: 369 on Top Layer, 370 on Bottom Layer, 77 on Inner1, 28 on Inner2

## Text on the board
Bottom Silkscreen Layer: SRC-ControlBoard
Top Silkscreen Layer: MOTOR-DRIVER 1 | Communication | I Get Ball | FREQ | MOTOR-DRIVER 5 | NUM | MODE | MOTOR-DRIVER 4 | MOTOR-DRIVER 2 | MOTOR-DRIVER 3
